# Altium schematic sheet Scheme.SchDoc
size A1
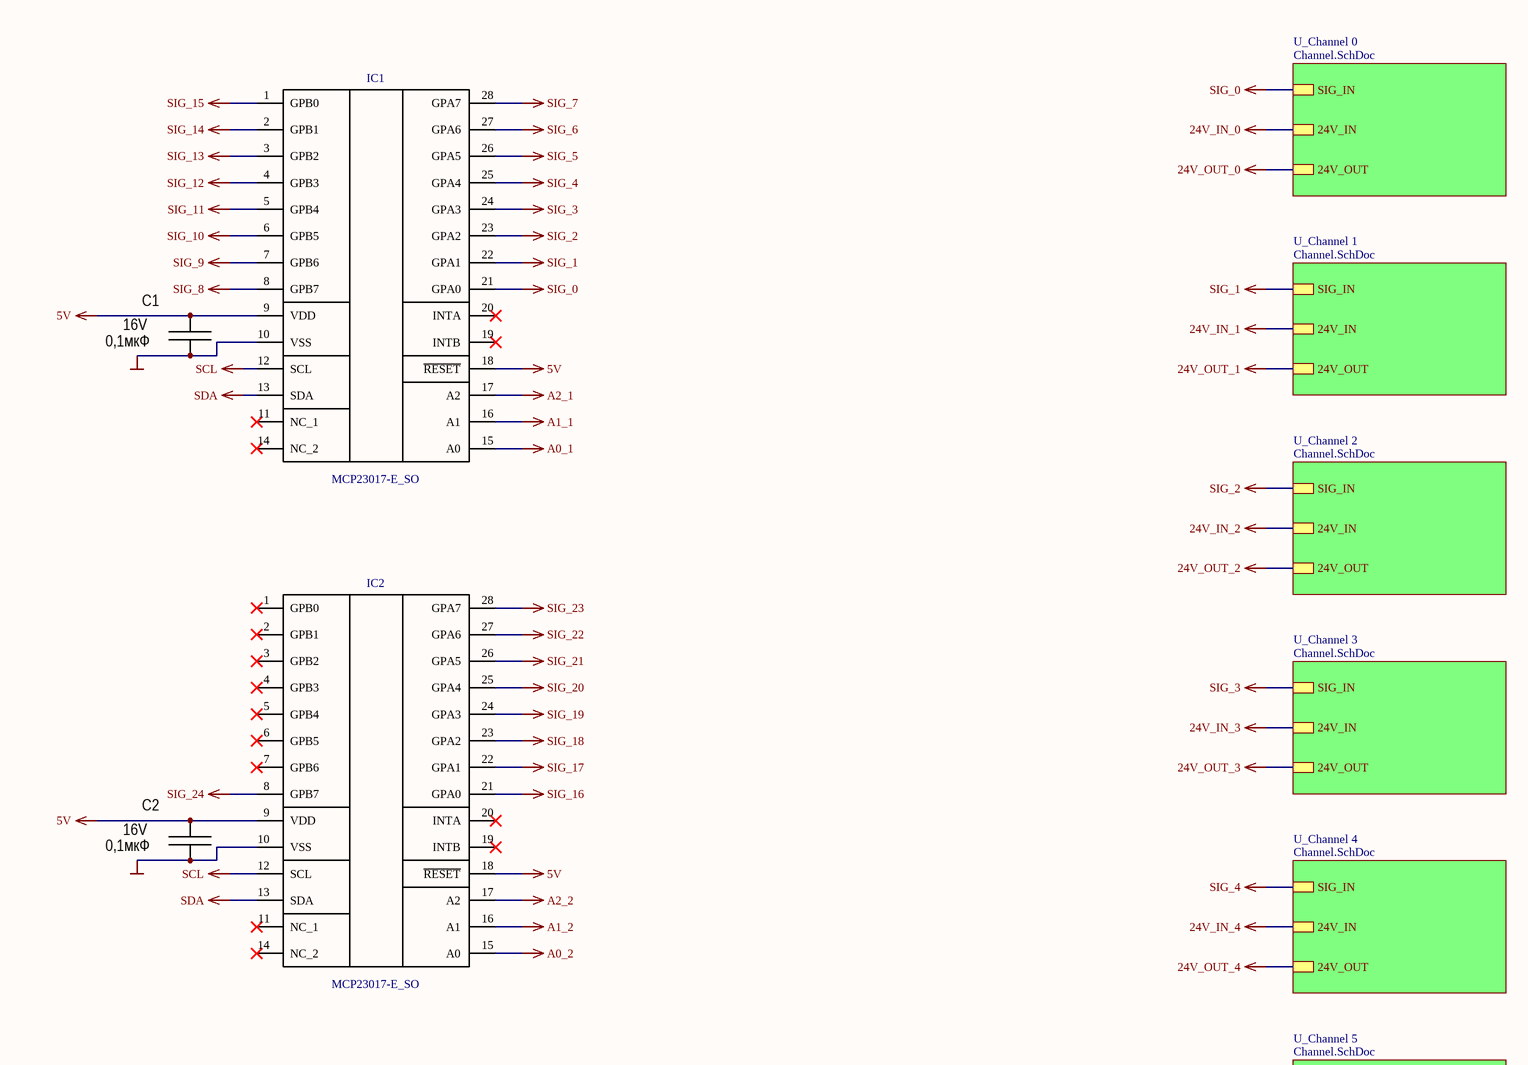
[diagram p0: Scheme.SchDoc, top left]
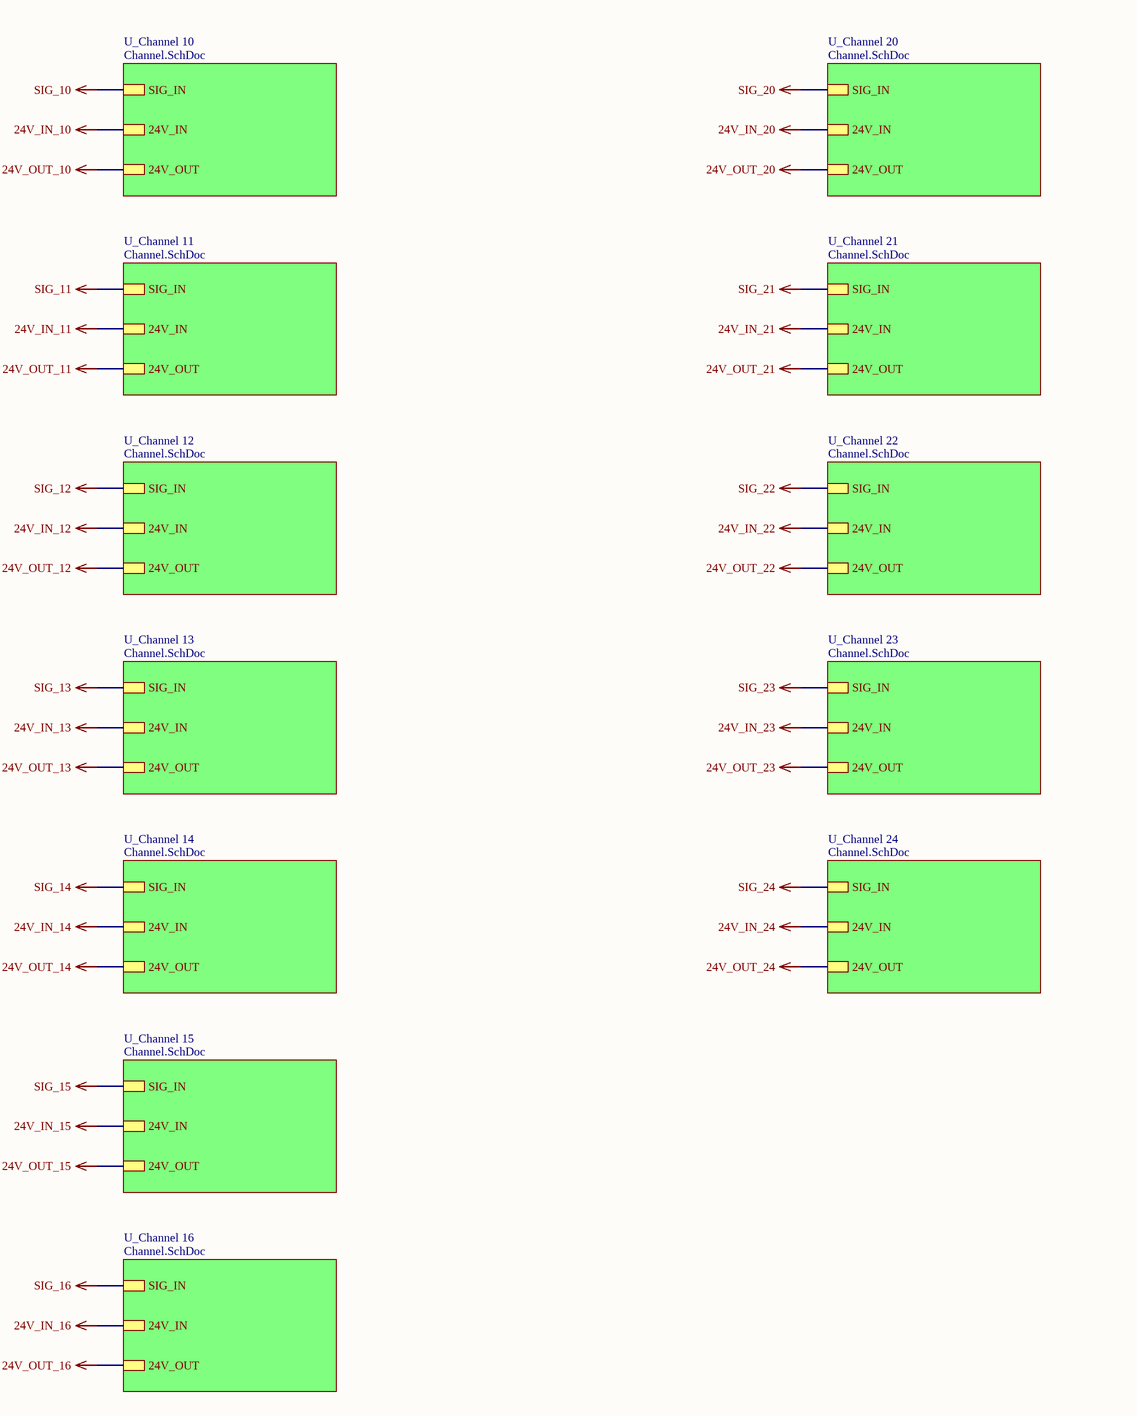
[diagram p1: Scheme.SchDoc, top right]
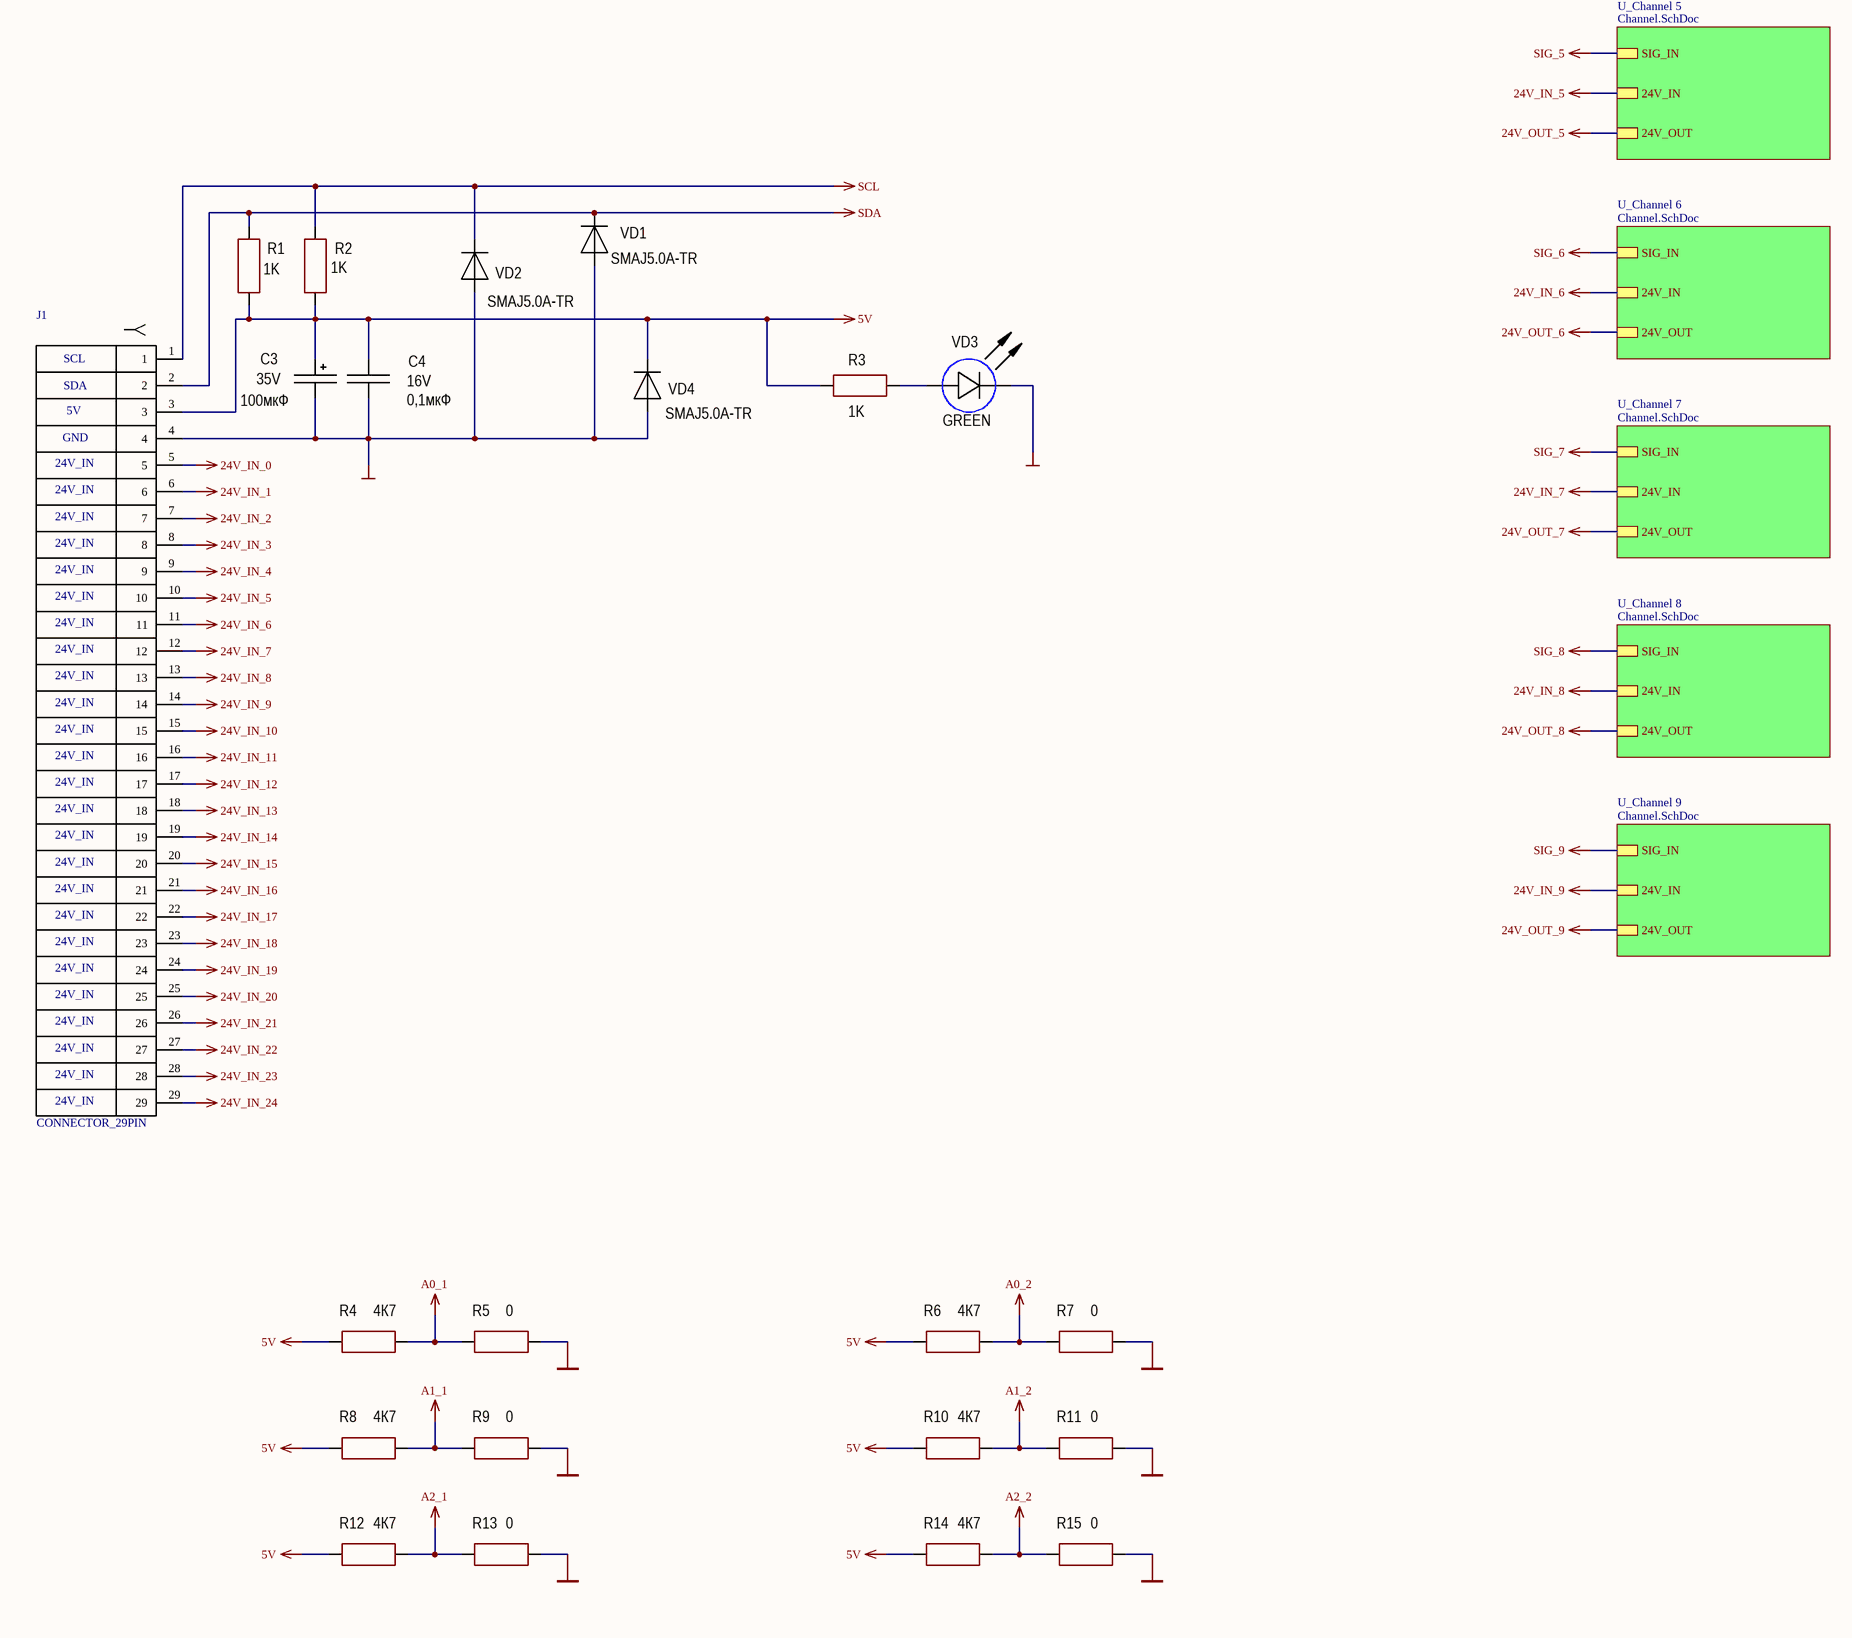
[diagram p2: Scheme.SchDoc, bottom left]
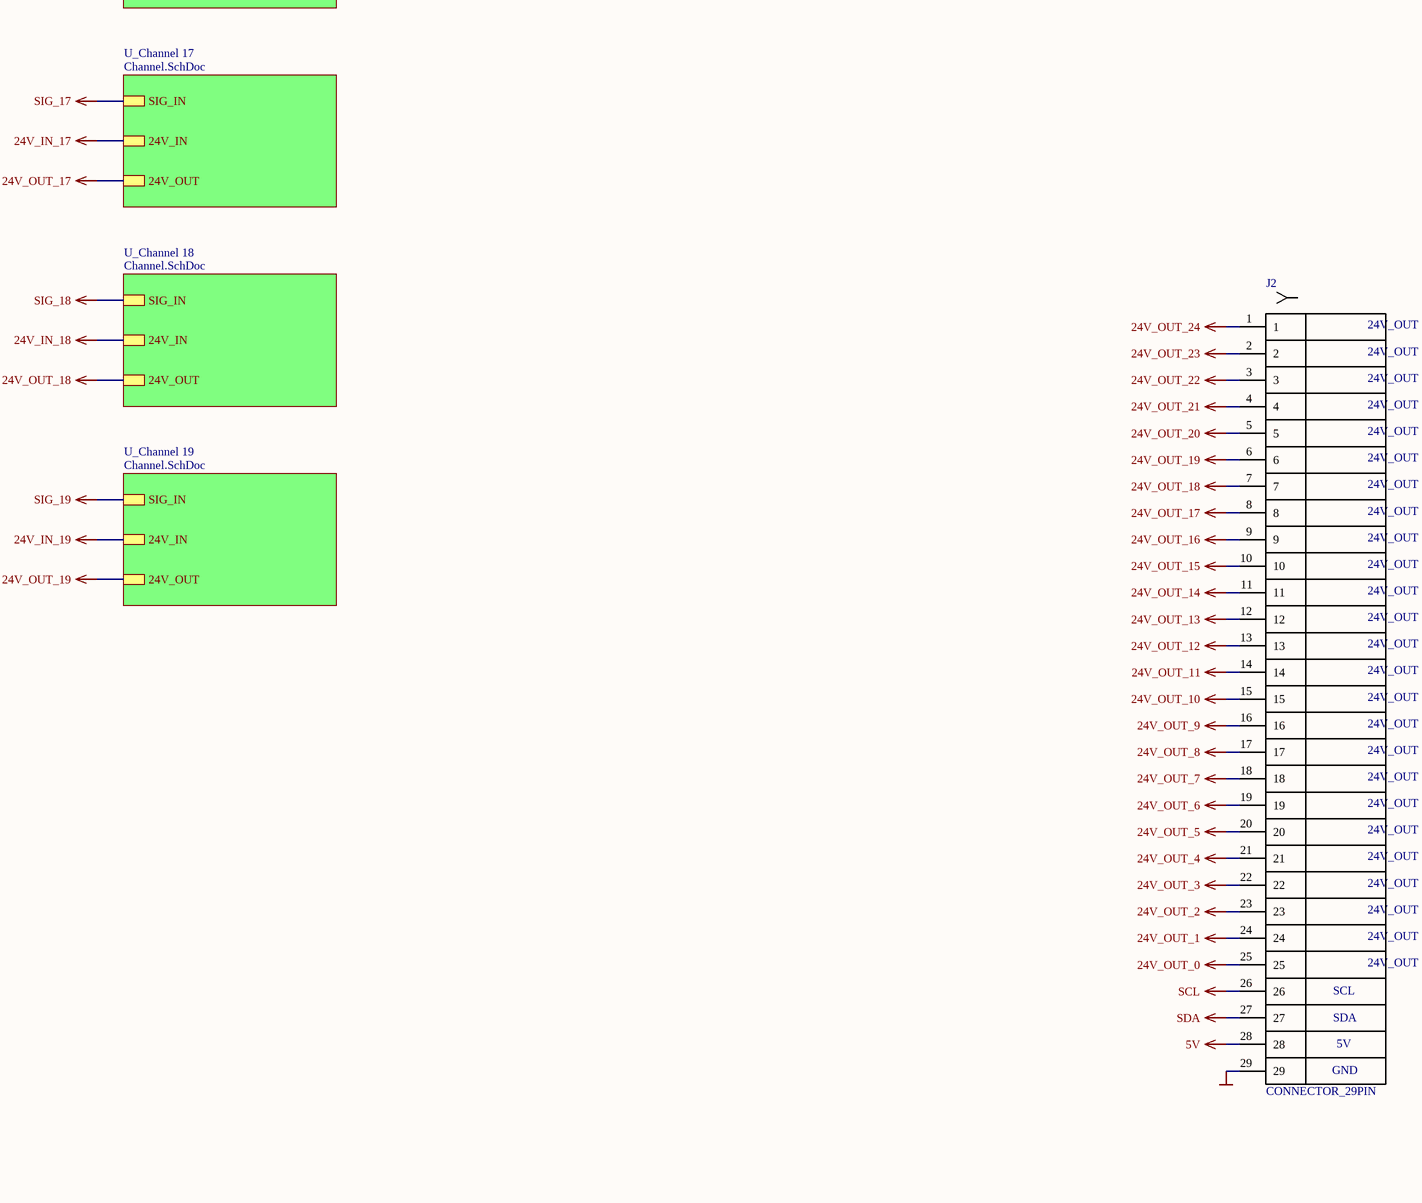
[diagram p3: Scheme.SchDoc, bottom right]

## Parts
C1  value 0,1мкФ  Voltage: 16V  [CAP: 0805]
C2  value 0,1мкФ  Voltage: 16V  [CAP: 0805]
C3  value 100мкФ  Voltage: 35V  [CAP: D8C3.5H12]
C4  value 0,1мкФ  Voltage: 16V  [CAP: 0805]
IC1  MCP23017-E_SO  [SOIC127P1030X265-28N]
IC2  MCP23017-E_SO  [SOIC127P1030X265-28N]
J1  CONNECTOR_29PIN  [Connector_29pin]
J2  CONNECTOR_29PIN  [Connector_29pin]
R1  value 1K  [RES: 0805]
R2  value 1K  [RES: 0805]
R3  value 1K  [RES: 0805]
R4  value 4К7  [RES: 0805]
R5  value 0  [RES: 0805]
R6  value 4К7  [RES: 0805]
R7  value 0  [RES: 0805]
R8  value 4К7  [RES: 0805]
R9  value 0  [RES: 0805]
R10  value 4К7  [RES: 0805]
R11  value 0  [RES: 0805]
R12  value 4К7  [RES: 0805]
R13  value 0  [RES: 0805]
R14  value 4К7  [RES: 0805]
R15  value 0  [RES: 0805]
VD1  PartNumber: SMAJ5.0A-TR  [DIODE: SMA]
VD2  PartNumber: SMAJ5.0A-TR  [DIODE: SMA]
VD3  Color: GREEN  [1224HRC5]
VD4  PartNumber: SMAJ5.0A-TR  [DIODE: SMA]

## Sub-sheets
U_Channel 0 = Channel.SchDoc: SIG_IN, 24V_IN, 24V_OUT
U_Channel 1 = Channel.SchDoc: SIG_IN, 24V_IN, 24V_OUT
U_Channel 2 = Channel.SchDoc: SIG_IN, 24V_IN, 24V_OUT
U_Channel 3 = Channel.SchDoc: SIG_IN, 24V_IN, 24V_OUT
U_Channel 4 = Channel.SchDoc: SIG_IN, 24V_IN, 24V_OUT
U_Channel 5 = Channel.SchDoc: SIG_IN, 24V_IN, 24V_OUT
U_Channel 6 = Channel.SchDoc: SIG_IN, 24V_IN, 24V_OUT
U_Channel 7 = Channel.SchDoc: SIG_IN, 24V_IN, 24V_OUT
U_Channel 8 = Channel.SchDoc: SIG_IN, 24V_IN, 24V_OUT
U_Channel 9 = Channel.SchDoc: SIG_IN, 24V_IN, 24V_OUT
U_Channel 10 = Channel.SchDoc: SIG_IN, 24V_IN, 24V_OUT
U_Channel 11 = Channel.SchDoc: SIG_IN, 24V_IN, 24V_OUT
U_Channel 12 = Channel.SchDoc: SIG_IN, 24V_IN, 24V_OUT
U_Channel 13 = Channel.SchDoc: SIG_IN, 24V_IN, 24V_OUT
U_Channel 14 = Channel.SchDoc: SIG_IN, 24V_IN, 24V_OUT
U_Channel 15 = Channel.SchDoc: SIG_IN, 24V_IN, 24V_OUT
U_Channel 16 = Channel.SchDoc: SIG_IN, 24V_IN, 24V_OUT
U_Channel 17 = Channel.SchDoc: SIG_IN, 24V_IN, 24V_OUT
U_Channel 18 = Channel.SchDoc: SIG_IN, 24V_IN, 24V_OUT
U_Channel 19 = Channel.SchDoc: SIG_IN, 24V_IN, 24V_OUT
U_Channel 20 = Channel.SchDoc: SIG_IN, 24V_IN, 24V_OUT
U_Channel 21 = Channel.SchDoc: SIG_IN, 24V_IN, 24V_OUT
U_Channel 22 = Channel.SchDoc: SIG_IN, 24V_IN, 24V_OUT
U_Channel 23 = Channel.SchDoc: SIG_IN, 24V_IN, 24V_OUT
U_Channel 24 = Channel.SchDoc: SIG_IN, 24V_IN, 24V_OUT

## Nets
5V: C1.2 C2.2 C3.1 C4.2 IC1.9(VDD) IC1.18(~{RESET}) IC2.9(VDD) IC2.18(~{RESET}) J1.3 J2.28 R1.1 R2.1 R3.1 R4.1 R6.1 R8.1 R10.1 R12.1 R14.1 VD4.2
24V_IN_0: J1.5 ; sheet U_Channel 0/24V_IN
24V_IN_1: J1.6 ; sheet U_Channel 1/24V_IN
24V_IN_2: J1.7 ; sheet U_Channel 2/24V_IN
24V_IN_3: J1.8 ; sheet U_Channel 3/24V_IN
24V_IN_4: J1.9 ; sheet U_Channel 4/24V_IN
24V_IN_5: J1.10 ; sheet U_Channel 5/24V_IN
24V_IN_6: J1.11 ; sheet U_Channel 6/24V_IN
24V_IN_7: J1.12 ; sheet U_Channel 7/24V_IN
24V_IN_8: J1.13 ; sheet U_Channel 8/24V_IN
24V_IN_9: J1.14 ; sheet U_Channel 9/24V_IN
24V_IN_10: J1.15 ; sheet U_Channel 10/24V_IN
24V_IN_11: J1.16 ; sheet U_Channel 11/24V_IN
24V_IN_12: J1.17 ; sheet U_Channel 12/24V_IN
24V_IN_13: J1.18 ; sheet U_Channel 13/24V_IN
24V_IN_14: J1.19 ; sheet U_Channel 14/24V_IN
24V_IN_15: J1.20 ; sheet U_Channel 15/24V_IN
24V_IN_16: J1.21 ; sheet U_Channel 16/24V_IN
24V_IN_17: J1.22 ; sheet U_Channel 17/24V_IN
24V_IN_18: J1.23 ; sheet U_Channel 18/24V_IN
24V_IN_19: J1.24 ; sheet U_Channel 19/24V_IN
24V_IN_20: J1.25 ; sheet U_Channel 20/24V_IN
24V_IN_21: J1.26 ; sheet U_Channel 21/24V_IN
24V_IN_22: J1.27 ; sheet U_Channel 22/24V_IN
24V_IN_23: J1.28 ; sheet U_Channel 23/24V_IN
24V_IN_24: J1.29 ; sheet U_Channel 24/24V_IN
24V_OUT_0: J2.25 ; sheet U_Channel 0/24V_OUT
24V_OUT_1: J2.24 ; sheet U_Channel 1/24V_OUT
24V_OUT_2: J2.23 ; sheet U_Channel 2/24V_OUT
24V_OUT_3: J2.22 ; sheet U_Channel 3/24V_OUT
24V_OUT_4: J2.21 ; sheet U_Channel 4/24V_OUT
24V_OUT_5: J2.20 ; sheet U_Channel 5/24V_OUT
24V_OUT_6: J2.19 ; sheet U_Channel 6/24V_OUT
24V_OUT_7: J2.18 ; sheet U_Channel 7/24V_OUT
24V_OUT_8: J2.17 ; sheet U_Channel 8/24V_OUT
24V_OUT_9: J2.16 ; sheet U_Channel 9/24V_OUT
24V_OUT_10: J2.15 ; sheet U_Channel 10/24V_OUT
24V_OUT_11: J2.14 ; sheet U_Channel 11/24V_OUT
24V_OUT_12: J2.13 ; sheet U_Channel 12/24V_OUT
24V_OUT_13: J2.12 ; sheet U_Channel 13/24V_OUT
24V_OUT_14: J2.11 ; sheet U_Channel 14/24V_OUT
24V_OUT_15: J2.10 ; sheet U_Channel 15/24V_OUT
24V_OUT_16: J2.9 ; sheet U_Channel 16/24V_OUT
24V_OUT_17: J2.8 ; sheet U_Channel 17/24V_OUT
24V_OUT_18: J2.7 ; sheet U_Channel 18/24V_OUT
24V_OUT_19: J2.6 ; sheet U_Channel 19/24V_OUT
24V_OUT_20: J2.5 ; sheet U_Channel 20/24V_OUT
24V_OUT_21: J2.4 ; sheet U_Channel 21/24V_OUT
24V_OUT_22: J2.3 ; sheet U_Channel 22/24V_OUT
24V_OUT_23: J2.2 ; sheet U_Channel 23/24V_OUT
24V_OUT_24: J2.1 ; sheet U_Channel 24/24V_OUT
A0_1: IC1.15(A0) R4.2 R5.1
A0_2: IC2.15(A0) R6.2 R7.1
A1_1: IC1.16(A1) R8.2 R9.1
A1_2: IC2.16(A1) R10.2 R11.1
A2_1: IC1.17(A2) R12.2 R13.1
A2_2: IC2.17(A2) R14.2 R15.1
GND: C1.1 C2.1 C3.2 C4.1 IC1.10(VSS) IC2.10(VSS) J1.4 J2.29 R5.2 R7.2 R9.2 R11.2 R13.2 R15.2 VD1.1 VD2.1 VD3.2(C) VD4.1
SCL: IC1.12(SCL) IC2.12(SCL) J1.1 J2.26 R2.2 VD2.2
SDA: IC1.13(SDA) IC2.13(SDA) J1.2 J2.27 R1.2 VD1.2
SIG_0: IC1.21(GPA0) ; sheet U_Channel 0/SIG_IN
SIG_1: IC1.22(GPA1) ; sheet U_Channel 1/SIG_IN
SIG_2: IC1.23(GPA2) ; sheet U_Channel 2/SIG_IN
SIG_3: IC1.24(GPA3) ; sheet U_Channel 3/SIG_IN
SIG_4: IC1.25(GPA4) ; sheet U_Channel 4/SIG_IN
SIG_5: IC1.26(GPA5) ; sheet U_Channel 5/SIG_IN
SIG_6: IC1.27(GPA6) ; sheet U_Channel 6/SIG_IN
SIG_7: IC1.28(GPA7) ; sheet U_Channel 7/SIG_IN
SIG_8: IC1.8(GPB7) ; sheet U_Channel 8/SIG_IN
SIG_9: IC1.7(GPB6) ; sheet U_Channel 9/SIG_IN
SIG_10: IC1.6(GPB5) ; sheet U_Channel 10/SIG_IN
SIG_11: IC1.5(GPB4) ; sheet U_Channel 11/SIG_IN
SIG_12: IC1.4(GPB3) ; sheet U_Channel 12/SIG_IN
SIG_13: IC1.3(GPB2) ; sheet U_Channel 13/SIG_IN
SIG_14: IC1.2(GPB1) ; sheet U_Channel 14/SIG_IN
SIG_15: IC1.1(GPB0) ; sheet U_Channel 15/SIG_IN
SIG_16: IC2.21(GPA0) ; sheet U_Channel 16/SIG_IN
SIG_17: IC2.22(GPA1) ; sheet U_Channel 17/SIG_IN
SIG_18: IC2.23(GPA2) ; sheet U_Channel 18/SIG_IN
SIG_19: IC2.24(GPA3) ; sheet U_Channel 19/SIG_IN
SIG_20: IC2.25(GPA4) ; sheet U_Channel 20/SIG_IN
SIG_21: IC2.26(GPA5) ; sheet U_Channel 21/SIG_IN
SIG_22: IC2.27(GPA6) ; sheet U_Channel 22/SIG_IN
SIG_23: IC2.28(GPA7) ; sheet U_Channel 23/SIG_IN
SIG_24: IC2.8(GPB7) ; sheet U_Channel 24/SIG_IN
NetR3_2: R3.2 VD3.1(A)

Not connected (* = marked no-connect by the designer): IC1 11(NC_1)* 14(NC_2)* 19(INTB)* 20(INTA)*; IC2 1(GPB0)* 2(GPB1)* 3(GPB2)* 4(GPB3)* 5(GPB4)* 6(GPB5)* 7(GPB6)* 11(NC_1)* 14(NC_2)* 19(INTB)* 20(INTA)*

## Notes on the sheet
- SDA
- SCL
- GND
- 5V
- 24V_IN
- 24V_OUT

## Library data of the parts
C1 C2 C4 = Ceramic_0805: Manufacturer: Yageo; PartNumber: CC0805KRX7R7BB104; ValueManufacturerPartNumber: Ceramic capacitor, 0,1мкФ, X7R, ±10%, 16V, 0805, -55...+125°C; TypeCapacitor: Ceramic capacitor; Tolerance: ±10%; TypeDielectric: X7R; Package: 0805; HelpURL: https://www.digikey.com/product-detail/en/yageo/CC0805KRX7R7BB104/311-1142-1-ND/303052; Temperature: -55...+125°C
C3 = Aluminium: Manufacturer: Wurth; PartNumber: 860080475013; ValueManufacturerPartNumber: Aluminium capacitor, 100мкФ, 35V, ±20%, 54mOhm, 14x10x5 mm, -55...+105°C; TypeCapacitor: Aluminium capacitor; Tolerance: ±20%; Impedance: 54mOhm; Package: 14x10x5 mm; HelpURL: https://www.digikey.com/product-detail/en/wurth-electronics-inc/860080475013/732-9029-1-ND/5728972; Temperature: -55...+105°C
IC1 IC2 = MCP23017-E_SO: Integrated Circuit; Manufacturer_Name: Microchip; Manufacturer_Part_Number: MCP23017-E/SO; Datasheet Link: http://docs-emea.rs-online.com/webdocs/0a78/0900766b80a784c3.pdf; Height: 2.65mm; Mouser Part Number: 579-MCP23017-E/SO; Mouser Price/Stock: https://www.mouser.co.uk/ProductDetail/Microchip-Technology/MCP23017-E-SO?qs=usxtMOJb1Rz8hft7vV7YMQ%3D%3D; Arrow Part Number: MCP23017-E/SO; Arrow Price/Stock: https://www.arrow.com/en/products/mcp23017-eso/microchip-technology
J1 J2 = CONNECTOR_29PIN: Connector 29 pin
R1-R3 = Resistor_0805: Manufacturer: Yageo; PartNumber: RC0805JR-07100RL; ValueManufacturerPartNumber: Resistor film, 1K, ±5%, 0805, 0.125W, -55...+125°C; TypeResistor: Resistor film; Power: 0.125W; Tolerance: ±5%; Package: 0805; HelpURL: https://www.digikey.com/product-detail/en/yageo/RC0805JR-07100RL/311-100ARCT-ND/731185; Temperature: -55...+125°C
R4 R6 R8 R10 R12 R14 = Resistor_0805: Manufacturer: Yageo; PartNumber: RC0805JR-07100RL; ValueManufacturerPartNumber: Resistor film, 4К7, ±5%, 0805, 0.125W, -55...+125°C; TypeResistor: Resistor film; Power: 0.125W; Tolerance: ±5%; Package: 0805; HelpURL: https://www.digikey.com/product-detail/en/yageo/RC0805JR-07100RL/311-100ARCT-ND/731185; Temperature: -55...+125°C
R5 R7 R9 R11 R13 R15 = Resistor_0805: Manufacturer: Yageo; PartNumber: RC0805JR-07100RL; ValueManufacturerPartNumber: Resistor film, 0, ±5%, 0805, 0.125W, -55...+125°C; TypeResistor: Resistor film; Power: 0.125W; Tolerance: ±5%; Package: 0805; HelpURL: https://www.digikey.com/product-detail/en/yageo/RC0805JR-07100RL/311-100ARCT-ND/731185; Temperature: -55...+125°C
VD1 VD2 VD4 = Diode_single: Manufacturer: Micro Commercial; ValueManufacturerPartNumber: Single diode, 75V, 150mA, 1V, 4ns, SOD-323, -55...+150°C; TypeDiode: Single diode; Voltage: 75V; Current: 150mA; VoltageDrop: 1V; RecoveryTime: 4ns; Package: SOD-323; HelpURL: https://www.digikey.com/product-detail/en/micro-commercial-co/1N4148WX-TP/1N4148WXTPMSCT-ND/717312; Temperature: -55...+150°C
VD3 = LED_single: ValueManufacturerPartNumber: LED, Green, *, *, *, -55...+150°C; TypeDiode: LED; Manufacturer: *; Package: *; HelpURL: *; Temperature: -55...+150°C; Current: *; VoltageDrop: *; PartNumber: *; ColorParameter: Green